# Altium schematic sheet Sheet3.SchDoc
size A; SheetNumber: 3; SheetTotal: 3
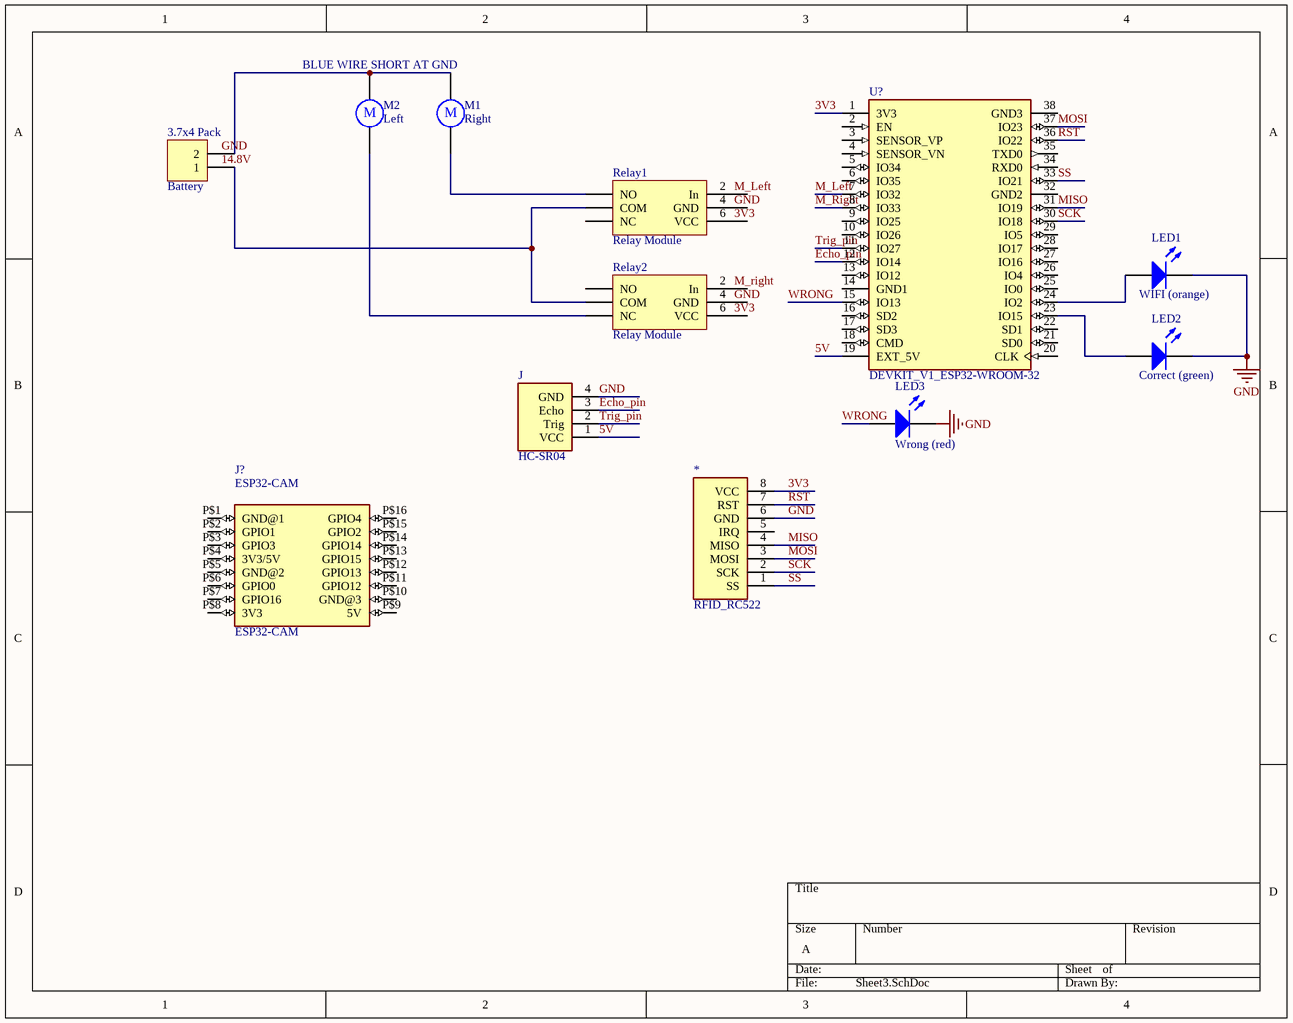
[diagram p0: Sheet3.SchDoc]

## Parts
3.7x4_Pack  Battery  [HDR1X2_R]
*  RFID_RC522
J  HC-SR04  [TE_282822-4]
J?  ESP32-CAM  [ESP32-CAM]
LED1  WIFI (orange)  [LED 0805 SMD]
LED2  Correct (green)  [LED 0805 SMD]
LED3  Wrong (red)  [LED 0805 SMD]
M1  Right  [RB5-10.5]
M2  Left  [RB5-10.5]
Relay1  Relay Module  [HDR3X2]
Relay2  Relay Module  [HDR3X2]
U?  DEVKIT_V1_ESP32-WROOM-32  [MODULE_DEVKIT_V1_ESP32-WROOM-32]

## Nets
GND: *.6(GND) J.4(GND) LED1.2(K) LED2.2(K) LED3.2(K)
3V3: *.8(VCC) U?.1(3V3)
5V: J.1(VCC) U?.19(EXT_5V)
Echo_pin: J.3(Echo) U?.12(IO14)
M_Left: U?.7(IO32)
M_Right: U?.8(IO33)
MISO: *.4(MISO) U?.31(IO19)
MOSI: *.3(MOSI) U?.37(IO23)
RST: *.7(RST) U?.36(IO22)
SCK: *.2(SCK) U?.30(IO18)
SS: *.1(SS) U?.33(IO21)
Trig_pin: J.2(Trig) U?.11(IO27)
WRONG: LED3.1(A) U?.15(IO13)
Net3.7x4_Pack_1: 3.7x4_Pack.1 Relay1.3(COM) Relay2.3(COM)
Net3.7x4_Pack_2: 3.7x4_Pack.2 M1.1 M2.1
NetLED1_1: LED1.1(A) U?.24(IO2)
NetLED2_1: LED2.1(A) U?.23(IO15)
NetM1_2: M1.2 Relay1.1(NO)
NetM2_2: M2.2 Relay2.5(NC)

Not connected (* = marked no-connect by the designer): * 5(IRQ); J? P$1(GND@1) P$2(GPIO1) P$3(GPIO3) P$4(3V3/5V) P$5(GND@2) P$6(GPIO0) P$7(GPIO16) P$8(3V3) P$9(5V) P$10(GND@3) P$11(GPIO12) P$12(GPIO13) P$13(GPIO15) P$14(GPIO14) P$15(GPIO2) P$16(GPIO4); Relay1 2(In) 4(GND) 5(NC) 6(VCC); Relay2 1(NO) 2(In) 4(GND) 6(VCC); U? 2(EN) 3(SENSOR_VP) 4(SENSOR_VN) 5(IO34) 6(IO35) 9(IO25) 10(IO26) 13(IO12) 14(GND1) 16(SD2) 17(SD3) 18(CMD) 20(CLK) 21(SD0) 22(SD1) 25(IO0) 26(IO4) 27(IO16) 28(IO17) 29(IO5) 32(GND2) 34(RXD0) 35(TXD0) 38(GND3)

## Notes on the sheet
- BLUE WIRE SHORT AT GND
- Labels drawn without touching a wire or pin: 3V3, 14.8V, GND, M_Left, M_right
- (in symbol Motor) M

## Library data of the parts
3.7x4_Pack = Socket_2X1: SOCKET 2POS .100" SINGL TIN; LatestRevisionDate: 17-Jul-2002; LatestRevisionNote: Re-released for DXP Platform.; Publisher: Altium Limited; Supplier 1: Digi-Key; Supplier Part Number 1: ED11155-ND; Value: Battery
J = HC-SR04: TERMI-BLOK HEADER,ASSY90 4P.; MF: TE Connectivity; MP: 282822-4; SnapEDA_Link: https://www.snapeda.com/parts/282822-4/TE%20Connectivity%20AMP%20Connectors/view-part/2404770/?ref=snap; EU_RoHS_Compliance: Compliant; Value: *; DigiKey-Purchase-URL: https://snapeda.com/shop?store=DigiKey&id=2404770; Package: None; Price: None; Availability: Good; Mouser-Purchase-URL: https://snapeda.com/shop?store=Mouser&id=2404770
J? = ESP32-CAM: ESP32 ESP32 Transceiver; 802.11 a/b/g/n (Wi-Fi, WiFi, WLAN), BluetoothÂ® Smart 4.x Low Energy (BLE) Evaluation Board; MF: AI-Thinker; SnapEDA_Link: https://www.snapeda.com/parts/ESP32-CAM/AI-Thinker/view-part/?ref=snap; Package: None; Value: *; MP: ESP32-CAM; Check_prices: https://www.snapeda.com/parts/ESP32-CAM/AI-Thinker/view-part/?ref=eda
LED1-LED3 = LED 0805 SMD: Green 571nm LED Indication - Discrete 2V 0805 (2012 Metric); Supplier 1: Digi-Key; Supplier Part Number 1: 160-1426-1-ND
  LED1: Value: WIFI (orange)
  LED2: Value: Correct (green)
  LED3: Value: Wrong (red)
M1 M2 = Motor: Motor, General Kind; Published: 24-Mar-1999; LatestRevisionDate: 17-Jul-2002; LatestRevisionNote: Re-released for DXP Platform.; PackageReference: RB5-10.5; Publisher: Altium Limited; PackageDescription: Capacitor (Radial); 2 Leads
Relay1 Relay2 = Relay: CONN HEADER 3POS .100" SINGL TIN; LatestRevisionDate: 17-Jul-2002; LatestRevisionNote: Re-released for DXP Platform.; Publisher: Altium Limited; Supplier 1: Digi-Key; Supplier Part Number 1: SAM1035-03-ND; Value: Relay Module
U? = DEVKIT_V1_ESP32-WROOM-32: WROOM-32 Development Board ESP32 ESP-32S WiFi Bluetooth Dev Module; MF: Espressif Systems; MP: DEVKIT V1 ESP32-WROOM-32; SnapEDA_Link: https://www.snapeda.com/parts/DEVKIT%20V1%20ESP32-WROOM-32/Espressif+Systems/view-part/?ref=snap; Package: Package; Value: *; Check_prices: https://www.snapeda.com/parts/DEVKIT%20V1%20ESP32-WROOM-32/Espressif+Systems/view-part/?ref=eda